# EasyEDA Pro project 电机驱动DRV8701_V1.0.epro

# Schematic DRV8701_V1.0
Board Name: DRV8701_V1.0; Create Date: 2024-12-12
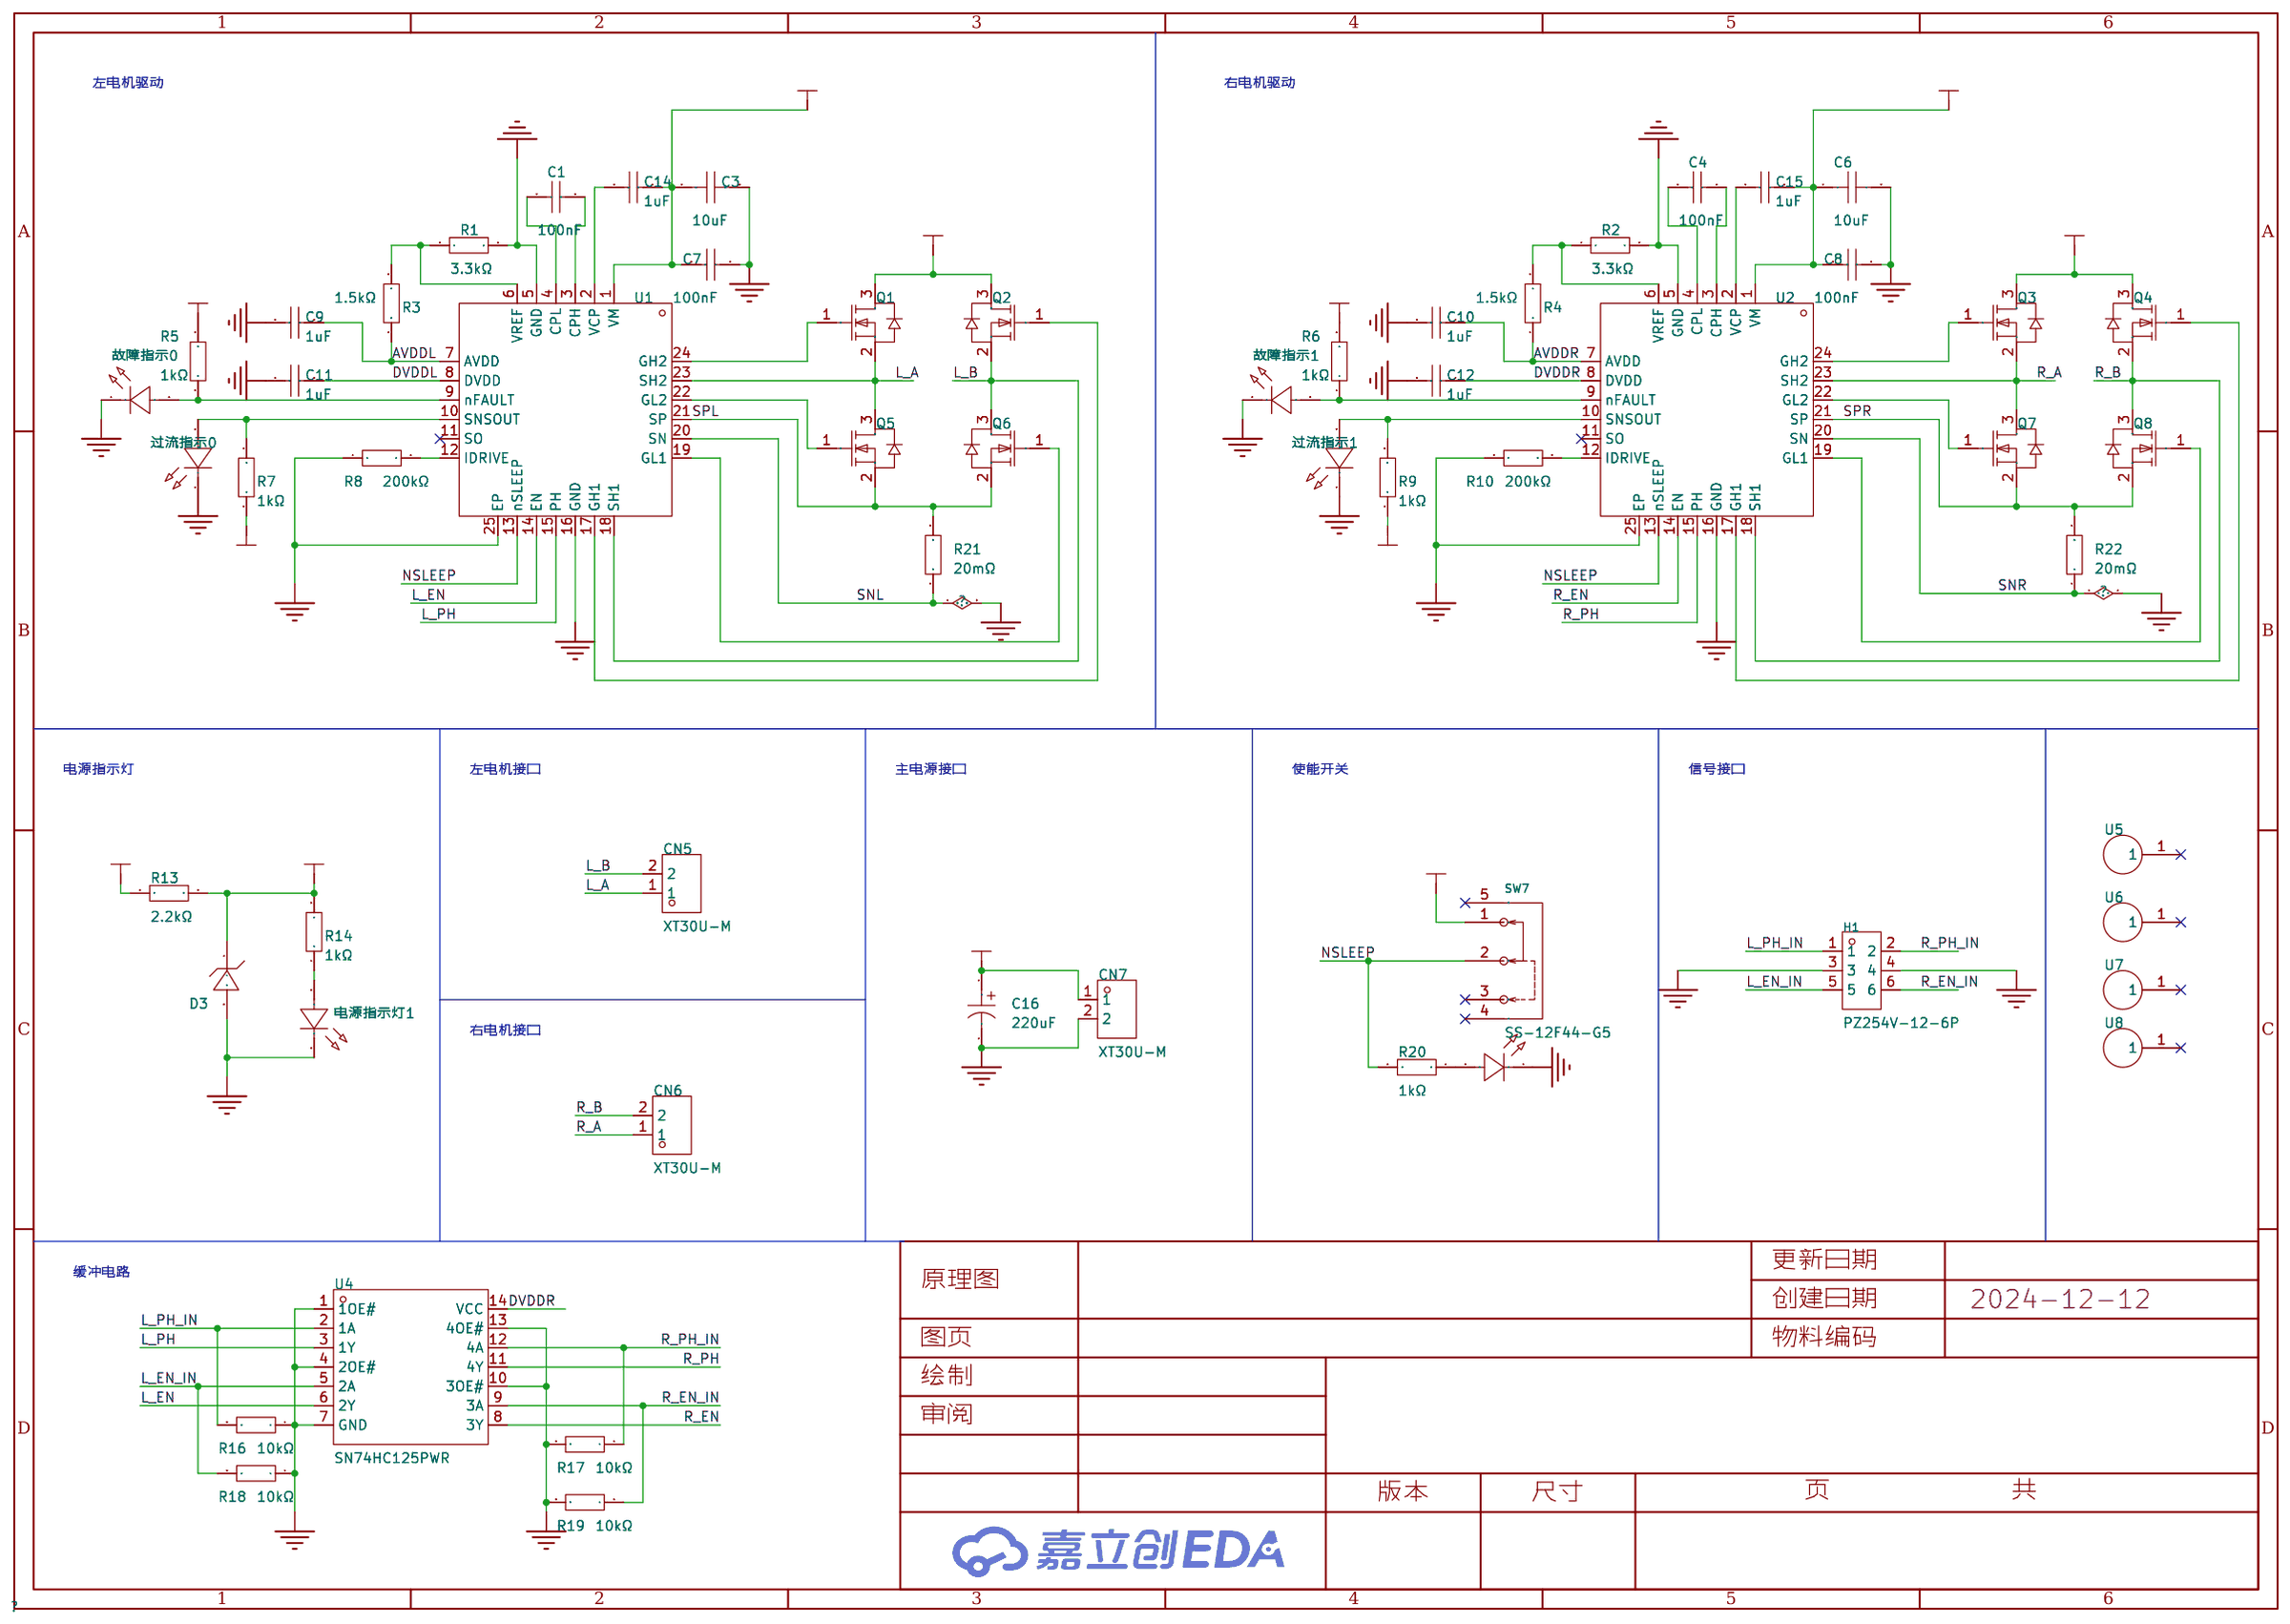
[diagram p0: schematic sheet]

## Parts
C1  100nF  [C0603]
C3  10uF  [C0603]
C4  100nF  [C0603]
C6  10uF  [C0603]
C7  100nF  [C0603]
C8  100nF  [C0603]
C9  1uF  [C0603]
C10  1uF  [C0603]
C11  1uF  [C0603]
C12  1uF  [C0603]
C14  1uF  [C0603]
C15  1uF  [C0603]
C16  220uF  [CAP-TH_BD6.3-P2.50-D0.5-FD]
CN5  XT30U-M  [CONN-TH_XT30U-M]
CN6  XT30U-M  [CONN-TH_XT30U-M]
CN7  XT30U-M  [CONN-TH_XT30U-M]
D3  BZT52C3V3-7-F  [SOD-123_L2.7-W1.6-LS3.7-RD]
H1  PZ254V-12-6P  [HDR-TH_6P-P2.54-V-M-R2-C3-S2.54]
Q1  2N7002  [DSOP-8_L5.0-W5.0-P1.27-LS6.0-BL-EP（rebuild）]
Q2  2N7002  [DSOP-8_L5.0-W5.0-P1.27-LS6.0-BL-EP（rebuild）]
Q3  2N7002  [DSOP-8_L5.0-W5.0-P1.27-LS6.0-BL-EP（rebuild）]
Q4  2N7002  [DSOP-8_L5.0-W5.0-P1.27-LS6.0-BL-EP（rebuild）]
Q5  2N7002  [DSOP-8_L5.0-W5.0-P1.27-LS6.0-BL-EP（rebuild）]
Q6  2N7002  [DSOP-8_L5.0-W5.0-P1.27-LS6.0-BL-EP（rebuild）]
Q7  2N7002  [DSOP-8_L5.0-W5.0-P1.27-LS6.0-BL-EP（rebuild）]
Q8  2N7002  [DSOP-8_L5.0-W5.0-P1.27-LS6.0-BL-EP（rebuild）]
R1  3.3kΩ  [R0603]
R2  3.3kΩ  [R0603]
R3  1.5kΩ  [R0603]
R4  1.5kΩ  [R0603]
R5  1kΩ  [R0603]
R6  1kΩ  [R0603]
R7  1kΩ  [R0603]
R8  200kΩ  [R0603]
R9  1kΩ  [R0603]
R10  200kΩ  [R0603]
R13  2.2kΩ  [R0603]
R14  1kΩ  [R0603]
R16  10kΩ  [R0603]
R17  10kΩ  [R0603]
R18  10kΩ  [R0603]
R19  10kΩ  [R0603]
R20  1kΩ  [R0603]
R21  20mΩ  [R1225]
R22  20mΩ  [R1225]
SW7  SS-12F44-G5  [SW-TH_SS-12F44-G5]
U1  DRV8701ERGET  [VQFN-24_L4.0-W4.0-P0.50-BL-EP2.5]
U2  DRV8701ERGET  [VQFN-24_L4.0-W4.0-P0.50-BL-EP2.5]
U4  SN74HC125PWR  [TSSOP-14_L5.0-W4.4-P0.65-LS6.5-BL]
U5  -  [M3螺丝孔]  (no BOM)
U6  -  [M3螺丝孔]  (no BOM)
U7  -  [M3螺丝孔]  (no BOM)
U8  -  [M3螺丝孔]  (no BOM)
故障指示0  XL-1608SURC-06  [LED0603-RD_RED]
故障指示1  XL-1608SURC-06  [LED0603-RD_RED]
电源指示灯1  XL-1608SURC-06  [LED0603-RD_RED]
电源指示灯2  XL-1608SURC-06  [LED0603-RD_RED]
过流指示0  XL-1608SURC-06  [LED0603-RD_RED]
过流指示1  XL-1608SURC-06  [LED0603-RD_RED]

## Library data of the parts
C1 C4 C7 C8 = CL10B104KO8NNNC: 容值:100nF;精度:±10%;额定电压:16V;材质(温度系数):X7R;; LCSC Part Name: 100nF ±10% 16V; Supplier Part: C66501; Manufacturer: SAMSUNG(三星); Supplier Footprint: 0603; JLCPCB Part Class: 扩展库; Datasheet: https://atta.szlcsc.com/upload/public/pdf/source/20160218/1457707763339.pdf; Supplier: LCSC; Tolerance: ±10%; Voltage Rated: 16V; Temperature Coefficient: X7R
C3 C6 = CL10A106MA8NRNC: 容值:10uF;精度:±20%;额定电压:25V;材质(温度系数):X5R;; LCSC Part Name: 10uF ±20% 25V; Supplier Part: C96446; Manufacturer: SAMSUNG(三星); Supplier Footprint: 0603; Datasheet: https://atta.szlcsc.com/upload/public/pdf/source/20160218/1457707763339.pdf; Supplier: LCSC; Tolerance: ±20%; Voltage Rated: 25V; Temperature Coefficient: X5R
C9-C12 C14 C15 = CL10B105KA8NNNC: 容值:1uF;精度:±10%;额定电压:25V;材质(温度系数):X7R;; LCSC Part Name: 1uF ±10% 25V; Supplier Part: C29936; Manufacturer: SAMSUNG(三星); Supplier Footprint: 0603; Datasheet: https://atta.szlcsc.com/upload/public/pdf/source/20160218/1457707763339.pdf; Supplier: LCSC; Tolerance: ±10%; Voltage Rated: 25V; Temperature Coefficient: X7R
C16 = 03EC0593: 容值:220uF;精度:±20%;额定电压:25V;纹波电流:400mA@100kHz;等效串联电阻:180mΩ@100kHz;; LCSC Part Name: 220uF ±20% 25V; Supplier Part: C2831777; Manufacturer: KNSCHA(科尼盛); Supplier Footprint: 插件,D6.3xL11.5mm; JLCPCB Part Class: 扩展库; Datasheet: https://atta.szlcsc.com/upload/public/pdf/source/20210511/C2831777_389FCE55455AE5EB982141C0CC76B0F0.pdf; Supplier: LCSC; Tolerance: ±20%; Rated Voltage: 25V; Ripple Current: 400mA@100kHz; Equivalent Series Resistance(ESR): 180mΩ@100kHz; Lead Spacing: 2.5mm; φD: 6.3mm; L: 11.5mm; Lifetime @ Temp: 7000hrs@105℃; Operating Temperature: -55℃~+105℃
CN5-CN7 = XT30U-M: 类别:-;类型1:-;; LCSC Part Name: AMASS(艾迈斯)轻量版锂电池插头公头 XT30U-M; Supplier Part: C99101; Manufacturer: AMASS(艾迈斯); JLCPCB Part Class: 扩展库; Datasheet: https://atta.szlcsc.com/upload/public/pdf/source/20170606/1496716542582.pdf; Supplier: LCSC; Brand: 艾迈斯; Type: 插头; Colour: 黄色; InterfaceType: 公头
D3 = BZT52C3V3-7-F: 二极管配置:独立式;稳压值(标称值):3.3V;稳压值(范围):3.1V~3.5V;功率:500mW;精度:±6%;; Supplier Part: C151564; Manufacturer: DIODES(美台); Supplier Footprint: SOD-123; Datasheet: https://atta.szlcsc.com/upload/public/pdf/source/20190711/C397931_3C6B91801DE45802E2D186F3C264AC27.pdf; Supplier: LCSC; Diode Configuration: 独立式; Zener Voltage (Nom): 3.3V; Reverse Leakage Current (Ir): 5uA@1V; Zener Voltage (Range): 3.1V~3.5V; Power Dissipation: 500mW; Zener Impedance (Zzt): 95Ω; Tolerance: ±6%
H1 = PZ254V-12-6P: 排数:双排;总PIN位数:6P;间距:2.54mm;插针结构:2x3P;行距:2.54mm;安装类型:直插;圆针/方针:方针;额定电流:-;额定电压:-;配合针长度:6mm;塑高:2.5mm;端接针长度:3mm;触头材质:黄铜;触头镀层:-;工作温度范围:-40℃~+105℃;颜色:黑色;; LCSC Part Name: 2.54mm 2x3P 直插 方针; Supplier Part: C492420; Manufacturer: XFCN(兴飞); Supplier Footprint: 插件,P=2.54mm; JLCPCB Part Class: Extended Part; Datasheet: https://atta.szlcsc.com/upload/public/pdf/source/20200309/C492420_BAECB307B001054C09D200388220EAE6.pdf; Supplier: LCSC; Number of Rows: 双排; Number of Pins: 6P; Pitch: 2.54mm; Pin Structure: 2x3P; Row Spacing: 2.54mm; Mounting Type: 直插; Circluar Pins/Square Pins: 方针; Length of Mating Pin: 6mm; Insulation Height: 2.5mm; Length of End Connection Pin: 3mm; Contact Material: 黄铜; Operating Temperature Range: -40℃~+105℃; Color: 黑色
Q1-Q8 = TPH1R403NL(rebuild): LCSC Part Name: 1个N沟道 耐压:60V 电流:115mA; Supplier Part: C8545; Manufacturer: CJ(江苏长电/长晶); Supplier Footprint: SOT-23; Datasheet: https://atta.szlcsc.com/upload/public/pdf/source/20171228/C164913_15144413269051213916.pdf; Supplier: LCSC; Type: 1个N沟道; Drain Source Voltage (Vdss): 60V; Continuous Drain Current (Id): 115mA; Drain Source On Resistance (RDS(on)@Vgs,Id): 5Ω@10V; Power Dissipation (Pd): 225mW; Gate Threshold Voltage (Vgs(th)@Id): 2.5V@250uA; Input Capacitance (Ciss@Vds): 50pF; Reverse Transfer Capacitance (Crss@Vds): 5pF; Operating Temperature: -55℃~+150℃
R1 R2 = 0603WAF3301T5E: 电阻类型:厚膜电阻;阻值:3.3kΩ;精度:±1%;功率:100mW;最大工作电压:75V;温度系数:±100ppm/℃;; LCSC Part Name: 3.3kΩ ±1% 100mW 厚膜电阻; Supplier Part: C22978; Manufacturer: UNI-ROYAL(厚声); Supplier Footprint: 0603; Datasheet: https://atta.szlcsc.com/upload/public/pdf/source/20200306/C422600_1E6D84923E4A46A82E41ADD87F860B5C.pdf; Supplier: LCSC; Type: 厚膜电阻; Tolerance: ±1%; Power(Watts): 100mW; Overload Voltage (Max): 75V; Temperature Coefficient: ±100ppm/℃; Operating Temperature Range: -55℃~+155℃
R3 R4 = 0603WAF1501T5E: 电阻类型:厚膜电阻;阻值:1.5kΩ;精度:±1%;功率:100mW;最大工作电压:75V;温度系数:±100ppm/℃;; LCSC Part Name: 1.5kΩ ±1% 100mW 厚膜电阻; Supplier Part: C22843; Manufacturer: UNI-ROYAL(厚声); Supplier Footprint: 0603; Datasheet: https://atta.szlcsc.com/upload/public/pdf/source/20200306/C422600_1E6D84923E4A46A82E41ADD87F860B5C.pdf; Supplier: LCSC; Type: 厚膜电阻; Tolerance: ±1%; Power(Watts): 100mW; Overload Voltage (Max): 75V; Temperature Coefficient: ±100ppm/℃; Operating Temperature Range: -55℃~+155℃
R5-R7 R9 R14 R20 = 0603WAF1001T5E: 电阻类型:厚膜电阻;阻值:1kΩ;精度:±1%;功率:100mW;最大工作电压:75V;温度系数:±100ppm/℃;; LCSC Part Name: 1kΩ ±1% 100mW 厚膜电阻; Supplier Part: C21190; Manufacturer: UNI-ROYAL(厚声); Supplier Footprint: 0603; JLCPCB Part Class: 基础库; Datasheet: https://atta.szlcsc.com/upload/public/pdf/source/20200306/C422600_1E6D84923E4A46A82E41ADD87F860B5C.pdf; Supplier: LCSC; Type: 厚膜电阻; Tolerance: ±1%; Power(Watts): 100mW; Overload Voltage (Max): 75V; Temperature Coefficient: ±100ppm/℃; Operating Temperature Range: -55℃~+155℃
R8 R10 = 0603WAF2003T5E: 电阻类型:厚膜电阻;阻值:200kΩ;精度:±1%;功率:100mW;最大工作电压:75V;温度系数:±100ppm/℃;; LCSC Part Name: 200kΩ ±1% 100mW 厚膜电阻; Supplier Part: C25811; Manufacturer: UNI-ROYAL(厚声); Supplier Footprint: 0603; Datasheet: https://atta.szlcsc.com/upload/public/pdf/source/20200306/C422600_1E6D84923E4A46A82E41ADD87F860B5C.pdf; Supplier: LCSC; Type: 厚膜电阻; Tolerance: ±1%; Power(Watts): 100mW; Overload Voltage (Max): 75V; Temperature Coefficient: ±100ppm/℃; Operating Temperature Range: -55℃~+155℃
R13 = 0603WAF2201T5E: 电阻类型:厚膜电阻;阻值:2.2kΩ;精度:±1%;功率:100mW;最大工作电压:75V;温度系数:±100ppm/℃;; LCSC Part Name: 2.2kΩ ±1% 100mW 厚膜电阻; Supplier Part: C4190; Manufacturer: UNI-ROYAL(厚声); Supplier Footprint: 0603; JLCPCB Part Class: 基础库; Datasheet: https://atta.szlcsc.com/upload/public/pdf/source/20200306/C422600_1E6D84923E4A46A82E41ADD87F860B5C.pdf; Supplier: LCSC; Type: 厚膜电阻; Tolerance: ±1%; Power(Watts): 100mW; Overload Voltage (Max): 75V; Temperature Coefficient: ±100ppm/℃; Operating Temperature Range: -55℃~+155℃
R16-R19 = 0603WAF1002T5E: 电阻类型:厚膜电阻;阻值:10kΩ;精度:±1%;功率:100mW;最大工作电压:75V;温度系数:±100ppm/℃;; LCSC Part Name: 厚膜电阻 10kΩ ±1% 100mW; Supplier Part: C25804; Manufacturer: UNI-ROYAL(厚声); Supplier Footprint: 0603; JLCPCB Part Class: 基础库; Datasheet: https://atta.szlcsc.com/upload/public/pdf/source/20200306/C422600_1E6D84923E4A46A82E41ADD87F860B5C.pdf; Supplier: LCSC; Type: 厚膜电阻; Tolerance: ±1%; Power(Watts): 100mW; Overload Voltage (Max): 75V; Temperature Coefficient: ±100ppm/℃; Operating Temperature Range: -55℃~+155℃
R21 R22 = CS25FTFR020: 阻值:20mΩ;精度:±1%;功率:3W;温度系数:±200ppm/℃;; LCSC Part Name: 20mΩ ±1% 3W; Supplier Part: C316192; Manufacturer: Viking(光颉); Supplier Footprint: 1225; JLCPCB Part Class: 扩展库; Datasheet: https://atta.szlcsc.com/upload/public/pdf/source/20181023/C316195_01C52CFF62541A3F740CC971DFEB7970.pdf; Supplier: LCSC; Tolerance: ±1%; Power(Watts): 3W; Temperature Coefficient: ±200ppm/℃
SW7 = SS-12F44-G5_C136718: 额定电流(DC):-;额定电压(DC):-;额定电流(AC):-;额定电压(AC):-;电路结构:单刀双掷;安装方式:直插;机械寿命:5千次;; LCSC Part Name: 直插双档 滑动开关; Supplier Part: C136718; Manufacturer: 韩国韩荣; Supplier Footprint: 插件; JLCPCB Part Class: 扩展库; Datasheet: https://atta.szlcsc.com/upload/public/pdf/source/20171123/C136718_15114108132111137440.pdf; Supplier: LCSC; Circuit: 单刀双掷; Mounting Style: 直插; Mechanical Life: 5千次; Actuator Style: 矩形柱状; Pin Style: PC引脚; Operating Temperature: -25℃~+70℃; Switch Height: 11mm
U1 U2 = DRV8701ERGET: DRV8701 47V H 桥智能栅极驱动器; LCSC Part Name: 有刷直流电机驱动芯片 5.5V; Supplier Part: C132049; Manufacturer: TI(德州仪器); Supplier Footprint: VQFN-24(4x4); Datasheet: https://www.ti.com/cn/lit/gpn/drv8701; Supplier: LCSC
U4 = SN74HC125PWR: 输入类型:-;电源电压:2V~6V;元件数:4;每个元件位数:1;灌电流(IOL):7.8mA;拉电流(IOH):7.8mA;; Supplier Part: C132994; Manufacturer: TI(德州仪器); Supplier Footprint: TSSOP-14; JLCPCB Part Class: 扩展库; Datasheet: https://www.ti.com/cn/lit/gpn/sn74hc125; Supplier: LCSC; output type: 三态; Supply Voltage: 2V~6V; Number of Elements: 4; Number of Bits per Element: 1; Sink Current: 7.8mA; Source Current: 7.8mA; Logic Family: 74HC; Operating Temperature: -40℃~+85℃
U5-U8 = M3螺丝孔
故障指示0 故障指示1 电源指示灯1 电源指示灯2 过流指示0 过流指示1 = XL-1608SURC-06: 发光颜色:红色;功率:55mW;正向电流:25mA;主波长:617nm~621nm;透镜颜色:无色透明透镜;色温:-;发光角度:120°;载带方式:正贴;工作温度:-30℃~+85℃;; Supplier Part: C965799; Manufacturer: XINGLIGHT(成兴光); Supplier Footprint: 0603; Datasheet: https://atta.szlcsc.com/upload/public/pdf/source/20221102/D860AFDD1CDB02C5A8064103A32707E2.pdf; Supplier: LCSC; Emitted Color: 红色; Power Dissipation: 55mW; Forward Current: 25mA; Dominant Wavelength: 617nm~621nm; Peak Wavelength: 623nm; Lens Color: 无色透明透镜; Viewing Angle: 120°; Mounting Sytle: 正贴; Operating Temperature: -30℃~+85℃

## Nets
3.3V: D3.1(K) R13.2 R14.2 SW7.1
AVDDL: C9.1 R3.1 U1.7(AVDD)
AVDDR: C10.1 R4.1 U2.7(AVDD)
DVDDL: C11.1 R5.2 R7.1 U1.8(DVDD)
DVDDR: C12.1 R6.2 R9.1 U2.8(DVDD) U4.14(VCC)
GND: C3.2 C6.2 C7.1 C8.1 C9.2 C10.2 C11.2 C12.2 C16.2 CN7.2 D3.2(A) H1.3 H1.4 R1.2 R2.2 R8.1 R10.1 R16.1 R17.2 R18.1 R19.2 R21.1 R22.1 U1.5(GND) U1.16(GND) U1.20(SN) U1.25(EP) U2.5(GND) U2.16(GND) U2.20(SN) U2.25(EP) U4.1(1OE#) U4.4(2OE#) U4.7(GND) U4.10(3OE#) U4.13(4OE#) 故障指示0.1(K) 故障指示1.1(K) 电源指示灯1.1(K) 电源指示灯2.1(K) 过流指示0.1(K) 过流指示1.1(K)
L_A: CN5.1 Q1.2(S) Q5.3(D) U1.23(SH2)
L_B: CN5.2 Q2.2(S) Q6.3(D) U1.18(SH1)
L_EN: U1.14(EN) U4.6(2Y)
L_EN_IN: H1.5 R18.2 U4.5(2A)
L_PH: U1.15(PH) U4.3(1Y)
L_PH_IN: H1.1 R16.2 U4.2(1A)
NSLEEP: R20.2 SW7.2 U1.13(nSLEEP) U2.13(nSLEEP)
R_A: CN6.1 Q3.2(S) Q7.3(D) U2.23(SH2)
R_B: CN6.2 Q4.2(S) Q8.3(D) U2.18(SH1)
R_EN: U2.14(EN) U4.8(3Y)
R_EN_IN: H1.6 R19.1 U4.9(3A)
R_PH: U2.15(PH) U4.11(4Y)
R_PH_IN: H1.2 R17.1 U4.12(4A)
SPL: Q5.2(S) Q6.2(S) R21.2 U1.21(SP)
SPR: Q7.2(S) Q8.2(S) R22.2 U2.21(SP)
VM: C3.1 C6.1 C7.2 C8.2 C14.1 C15.1 C16.1 CN7.1 Q1.3(D) Q2.3(D) Q3.3(D) Q4.3(D) R13.1 U1.1(VM) U2.1(VM)
$1N2924: C14.2 U1.2(VCP)
$1N2925: C1.1 U1.3(CPH)
$1N2926: C1.2 U1.4(CPL)
$1N2930: Q1.1(G) U1.24(GH2)
$1N2931: Q5.1(G) U1.22(GL2)
$1N2933: Q6.1(G) U1.19(GL1)
$1N2936: Q2.1(G) U1.17(GH1)
$1N2948: R8.2 U1.12(IDRIVE)
$1N2972: R1.1 R3.2 U1.6(VREF)
$1N2976: R5.1 U1.9(nFAULT) 故障指示0.2(A)
$1N2979: R7.2 U1.10(SNSOUT) 过流指示0.2(A)
$1N2986: C15.2 U2.2(VCP)
$1N2987: C4.1 U2.3(CPH)
$1N2988: C4.2 U2.4(CPL)
$1N2992: Q3.1(G) U2.24(GH2)
$1N2993: Q7.1(G) U2.22(GL2)
$1N2995: Q8.1(G) U2.19(GL1)
$1N2998: Q4.1(G) U2.17(GH1)
$1N3010: R10.2 U2.12(IDRIVE)
$1N3014: R2.1 R4.2 U2.6(VREF)
$1N3018: R6.1 U2.9(nFAULT) 故障指示1.2(A)
$1N3021: R9.2 U2.10(SNSOUT) 过流指示1.2(A)
$1N3029: R14.1 电源指示灯1.2(A)
$1N3716: R20.1 电源指示灯2.2(A)

Not connected (* = marked no-connect by the designer): SW7 3* 4* 5*; U1 11(SO)*; U2 11(SO)*; U5 1*; U6 1*; U7 1*; U8 1*

## Notes on the sheet
- 左电机驱动
- 右电机驱动
- 电源指示灯
- 左电机接口
- 主电源接口
- 使能开关
- 信号接口
- 右电机接口
- 缓冲电路

# Board DRV8701_V1.0
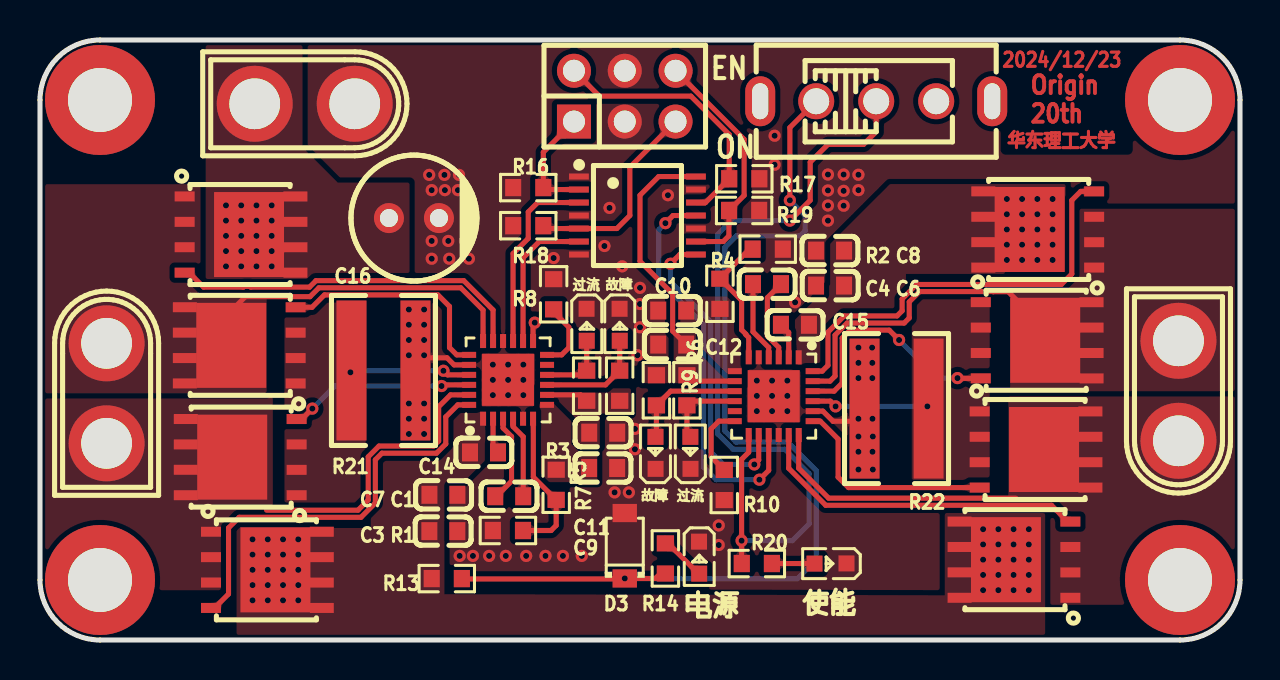
[diagram p1: board, top side]
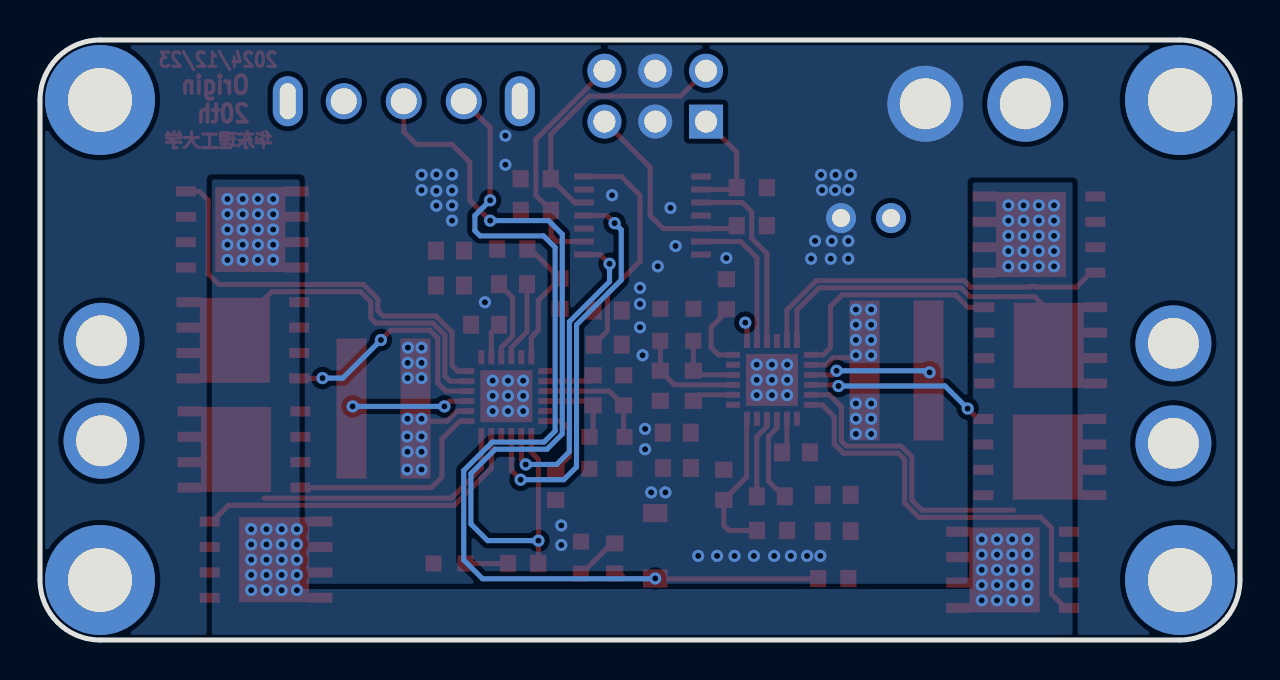
[diagram p2: board, bottom side, seen from below]

Outline 60 x 30 mm; copper layers: Top Layer, Inner1, Inner2, Bottom Layer. Coordinates in mm from the lower left corner of the outline.
Outline path: 0,27 0,3 arc(0.88,0.88) 3,0 57,0 arc(59.12,0.88) 60,3 60,27 arc(59.12,29.12) 57,30 3,30 arc(0.88,29.12) 0,27
Stack: Top Layer 0.035mm 外层铜厚1oz / Dielectric1 0.2104mm 7628 RC49% 8.6mil / Inner1 0.0152mm 内层铜厚 / Dielectric2 1.065mm 1.1mm H/HOZ Copper / Inner2 0.0152mm 内层铜厚 / Dielectric3 0.2104mm 7628 RC49% 8.6mil / Bottom Layer 0.035mm 外层铜厚1oz

## Design rules (mm)
template: 4层
spacing copperThickness1oz (default): track to track 0.102, other pairs 0.152 to 0.3
spacing copperThickness2oz: track to track 0.203, other pairs 0.152 to 0.3
spacing copperThicknessInner0.5oz: track to track 0.089, other pairs 0.152 to 0.3
spacing 板框焊盘0间距: track to track 0.152, other pairs 0 to 0.3
track width copperThickness1oz (default): min 0.102, default 0.254, max 2.54
track width copperThickness2oz: min 0.203, default 0.254, max 2.54
track width copperThickness0.5oz: min 0.089, default 0.254, max 2.54
differential pair differentialPair (default): width min 0.127, default 0.254, max 2.54; gap min 0.152, default 0.152
via viaSize (default): diameter min 0.3, default 0.61, max 10; hole min 0.2, default 0.305, max 6.3
region e13 uses 板框焊盘0间距
region e14 uses 板框焊盘0间距
region e15 uses 板框焊盘0间距
region e59 uses 板框焊盘0间距

## Placement (name value [footprint] x y rotation side)
C1  100nF  [C0603]  23.46 7.19 0 top
C3  10uF  [C0603]  20.17 5.44 0 top
C4  100nF  [C0603]  36.35 17.79 180 top
C6  10uF  [C0603]  39.5 17.72 180 top
C7  100nF  [C0603]  20.17 7.26 180 top
C8  100nF  [C0603]  39.5 19.47 0 top
C9  1uF  [C0603]  28.16 8.6 0 top
C10  1uF  [C0603]  31.61 16.47 180 top
C11  1uF  [C0603]  28.16 10.37 0 top
C12  1uF  [C0603]  31.61 14.77 180 top
C14  1uF  [C0603]  22.2 9.38 0 top
C15  1uF  [C0603]  37.75 15.76 180 top
C16  220uF  [CAP-TH_BD6.3-P2.50-D0.5-FD]  18.7 21.1 0 top
CN5  XT30U-M  [CONN-TH_XT30U-M]  3.33 12.33 90 top
CN6  XT30U-M  [CONN-TH_XT30U-M]  56.92 12.46 270 top
CN7  XT30U-M  [CONN-TH_XT30U-M]  13.24 26.81 0 top
D3  BZT52C3V3-7-F  [SOD-123_L2.7-W1.6-LS3.7-RD]  29.24 4.71 90 top
H1  PZ254V-12-6P  [HDR-TH_6P-P2.54-V-M-R2-C3-S2.54]  29.24 27.19 0 top
Q1  2N7002  [DSOP-8_L5.0-W5.0-P1.27-LS6.0-BL-EP（rebuild）]  11.32 3.51 270 top
Q2  2N7002  [DSOP-8_L5.0-W5.0-P1.27-LS6.0-BL-EP（rebuild）]  10 20.27 270 top
Q3  2N7002  [DSOP-8_L5.0-W5.0-P1.27-LS6.0-BL-EP（rebuild）]  49.94 20.53 90 top
Q4  2N7002  [DSOP-8_L5.0-W5.0-P1.27-LS6.0-BL-EP（rebuild）]  48.75 4.02 90 top
Q5  2N7002  [DSOP-8_L5.0-W5.0-P1.27-LS6.0-BL-EP（rebuild）]  10.06 9.14 90 top
Q6  2N7002  [DSOP-8_L5.0-W5.0-P1.27-LS6.0-BL-EP（rebuild）]  10.01 14.73 90 top
Q7  2N7002  [DSOP-8_L5.0-W5.0-P1.27-LS6.0-BL-EP（rebuild）]  49.81 14.99 270 top
Q8  2N7002  [DSOP-8_L5.0-W5.0-P1.27-LS6.0-BL-EP（rebuild）]  49.75 9.53 270 top
R1  3.3kΩ  [R0603]  23.4 5.47 180 top
R2  3.3kΩ  [R0603]  36.39 19.54 0 top
R3  1.5kΩ  [R0603]  25.81 7.76 270 top
R4  1.5kΩ  [R0603]  34 17.31 90 top
R5  1kΩ  [R0603]  28.98 12.71 270 top
R6  1kΩ  [R0603]  30.82 12.48 90 top
R7  1kΩ  [R0603]  27.33 12.71 90 top
R8  200kΩ  [R0603]  25.68 17.29 270 top
R9  1kΩ  [R0603]  32.34 12.48 270 top
R10  200kΩ  [R0603]  34.21 7.75 90 top
R13  2.2kΩ  [R0603]  20.34 3.07 0 top
R14  1kΩ  [R0603]  31.27 4.08 270 top
R16  10kΩ  [R0603]  24.41 22.62 0 top
R17  10kΩ  [R0603]  35.22 23.06 0 top
R18  10kΩ  [R0603]  24.41 20.72 0 top
R19  10kΩ  [R0603]  35.21 21.48 0 top
R20  1kΩ  [R0603]  35.84 3.82 180 top
R21  20mΩ  [R1225]  17.17 13.48 180 top
R22  20mΩ  [R1225]  42.83 11.57 0 top
SW7  SS-12F44-G5  [SW-TH_SS-12F44-G5]  41.81 26.94 0 top
U1  DRV8701ERGET  [VQFN-24_L4.0-W4.0-P0.50-BL-EP2.5]  23.4 13.01 0 top
U2  DRV8701ERGET  [VQFN-24_L4.0-W4.0-P0.50-BL-EP2.5]  36.69 12.19 180 top
U4  SN74HC125PWR  [TSSOP-14_L5.0-W4.4-P0.65-LS6.5-BL]  29.87 21.22 270 top
U5  -  [M3螺丝孔]  57 27 0 top
U6  -  [M3螺丝孔]  57 3 0 top
U7  -  [M3螺丝孔]  3 3 0 top
U8  -  [M3螺丝孔]  3 27 0 top
故障指示0  XL-1608SURC-06  [LED0603-RD_RED]  28.98 15.76 270 top
故障指示1  XL-1608SURC-06  [LED0603-RD_RED]  30.78 9.36 90 top
电源指示灯1  XL-1608SURC-06  [LED0603-RD_RED]  32.96 4.12 270 top
电源指示灯2  XL-1608SURC-06  [LED0603-RD_RED]  39.53 3.82 180 top
过流指示0  XL-1608SURC-06  [LED0603-RD_RED]  27.33 15.76 270 top
过流指示1  XL-1608SURC-06  [LED0603-RD_RED]  32.52 9.36 90 top

## Footprints (pads in the part's own frame, mm; a bottom-side part is the same pattern mirrored in y, then rotated)
C0603
  rect 0.8x0.9 smd: 1(-0.7,0) 2(0.7,0)
CAP-TH_BD6.3-P2.50-D0.5-FD
  round 1.5 hole 0.9: 1(-1.25,0) 2(1.25,0)
CONN-TH_XT30U-M
  round 3.8 hole 2.54: 1(-2.5,0) 2(2.5,0)
DSOP-8_L5.0-W5.0-P1.27-LS6.0-BL-EP（rebuild）
  rect 0.5x1 smd: 1(1.905,-2.77) 2(-1.905,-2.77) 2(-0.635,-2.77) 2(0.634,-2.77)
  rect 0.5x1.2 smd: 3(-1.905,2.77) 3(-0.634,2.77) 3(0.635,2.77) 3(1.905,2.77)
  custom 4.25x3.5 smd: 3(0,0.45)
HDR-TH_6P-P2.54-V-M-R2-C3-S2.54
  rect 1.7x1.7 hole 1.1: 1(-2.54,-1.27)
  round 1.7 hole 1.1: 2(-2.54,1.27) 3(0,-1.27) 4(0,1.27) 5(2.54,-1.27) 6(2.54,1.27)
LED0603-RD_RED
  rect 0.8x0.8 smd: 1(-0.799,-0.004) 2(0.799,0.004)
M3螺丝孔
  round 5.5 hole 3.2: 1(0,0)
R0603
  rect 0.806x0.864 smd: 1(-0.753,0) 2(0.753,0)
R1225
  rect 1.5x7 smd: 1(-1.6,0) 2(1.6,0)
SOD-123_L2.7-W1.6-LS3.7-RD
  rect 0.91x1.22 smd: 1(-1.635,0) 2(1.635,0)
SW-TH_SS-12F44-G5
  round 1.8 hole 1.3: 1(-3,0) 2(0,0) 3(3,0)
  oval 1.5x2.5 hole 0.8x1.8: 4(5.8,0) 5(-5.8,0)
TSSOP-14_L5.0-W4.4-P0.65-LS6.5-BL
  rect 0.305x0.991 smd: 1(-1.95,-2.925) 2(-1.3,-2.925) 3(-0.65,-2.925) 4(0,-2.925) 5(0.65,-2.925) 6(1.3,-2.925) 7(1.95,-2.925) 8(1.95,2.925) 9(1.3,2.925) 10(0.65,2.925) 11(0,2.925) 12(-0.65,2.925) 13(-1.3,2.925) 14(-1.95,2.925)
VQFN-24_L4.0-W4.0-P0.50-BL-EP2.5
  rect 0.3x0.7 smd: 1(-1.25,-1.942) 2(-0.75,-1.942) 3(-0.25,-1.942) 4(0.25,-1.942) 5(0.75,-1.942) 6(1.25,-1.942) 13(1.25,1.942) 14(0.75,1.942) 15(0.25,1.942) 16(-0.25,1.942) 17(-0.75,1.942) 18(-1.25,1.942)
  rect 0.7x0.3 smd: 7(1.948,-1.25) 8(1.948,-0.75) 9(1.948,-0.25) 10(1.948,0.25) 11(1.948,0.75) 12(1.948,1.25) 19(-1.948,1.25) 20(-1.948,0.75) 21(-1.948,0.25) 22(-1.948,-0.25) 23(-1.948,-0.75) 24(-1.948,-1.25)
  rect 2.6x2.6 smd: 25(0.001,-0.001)

## Nets
As in the schematic.

Pads without a net: SW7 3 4 5; U1 11; U2 11; U5 1; U6 1; U7 1; U8 1

## Via types
v1: diameter 0.61, hole 0.305, Top Layer to Bottom Layer, 190 vias

## Routing (per net, layer and track width the routed paths; a pad name or vN(x,y) marks a point on that pad's centre or on a via; arc(x,y) is an arc through that point)
3.3V: length 51
  Top Layer w0.254: R13.2 21.11,3.05 29.21,3.05 v1(29.24,3.08) 30.77,3.08 31.02,3.32 R14.2 ; SW7.1 37.49,25.62 v1(37.49,21.98)
  Bottom Layer w0.254: v1(29.24,3.08) 29.25,3.06 37.87,3.06 38.81,4 38.81,8.47 37.39,9.89 34.8,9.89 34.24,10.45 34.24,19.62 34.83,20.21 38,20.21 38.25,20.46 38.25,21.22 v1(37.49,21.98)
DVDDL: length 2.1
  Top Layer w0.254: R7.1 27.04,12.26 U1.8
DVDDR: length 14.1
  Top Layer w0.254: 34.74,12.94 32.51,12.94 32.34,13.11 ; U4.14 30.93,23.17 30,22.24 30,18.94 31.63,17.3 31.63,15.45 C12.1
GND: length 5.6
  Top Layer w0.254: U1.20 20.7,13.76 20.35,14.11 19.41,14.11 R21.1 ; v1(40.92,11.06) 40.79,10.94 39.65,10.94 39.15,11.44 U2.20
  vias: v1(18.44,16.52) v1(18.44,15.76) v1(18.44,15) v1(18.44,14.24) v1(18.44,11.83) v1(18.44,11.06) v1(18.44,10.3) v1(19.21,16.52) v1(19.21,15.76) v1(19.21,15) v1(19.21,14.24) v1(19.21,11.83) v1(19.21,11.06) v1(19.21,10.3) v1(19.46,23.25) v1(19.59,22.49) v1(19.59,19.95) v1(19.59,19.06) v1(20.22,23.25) v1(20.24,22.49) v1(20.41,19.95) v1(20.46,19.06) v1(20.95,23.25) v1(20.9,22.49) v1(20.98,4.2) v1(21.25,19.95) v1(21.44,19.06) v1(21.65,4.2) v1(22.46,4.2) v1(22.64,13.77) v1(22.64,13.01) v1(22.64,12.24) v1(23.29,4.2) v1(23.41,13.77) v1(23.41,13.01) v1(23.41,12.24) v1(24.17,13.77) v1(24.17,13.01) v1(24.17,12.24) v1(24.31,4.2) v1(25.28,4.2) v1(25.68,19.1) v1(26.15,4.2) v1(27.09,4.2) v1(28.22,19.7) v1(28.48,21.6) v1(28.73,7.38) v1(29.11,18.68) v1(29.44,7.38) v1(29.75,10.56) v1(29.75,9.54) v1(29.87,14.24) v1(30,17.61) v1(30,16.8) v1(30,15.64) v1(31.4,22.24) v1(33.94,5.73) v1(33.94,4.75) v1(35.84,12.97) v1(35.84,12.21) v1(35.84,11.44) v1(36.6,12.97) v1(36.6,12.21) v1(36.6,11.44) v1(36.73,25.21) v1(36.73,23.76) v1(37.37,12.97) v1(37.37,12.21) v1(37.37,11.44) v1(37.75,16.89) v1(39.4,23.27) v1(39.4,22.48) v1(39.4,21.73) v1(39.4,20.97) v1(40.18,23.27) v1(40.18,22.46) v1(40.18,21.72) v1(40.92,23.26) v1(40.92,22.49) v1(40.92,14.62) v1(40.92,13.86) v1(40.92,13.09) v1(40.92,10.17) v1(40.92,9.41) v1(40.92,8.52) v1(41.6,14.62) v1(41.62,13.86) v1(41.62,13.09) v1(41.63,11.06) v1(41.64,10.17) v1(41.63,9.41) v1(41.64,8.52)
L_A: length 14.8
  Top Layer w0.254: 11.33,6.49 15.9,6.49 16.41,7 16.41,9.16 16.95,9.7 19.68,9.7 19.93,9.95 19.93,11.66 20.53,12.26 U1.23
L_B: length 16.8
  Top Layer w0.254: U1.18 22.15,16.5 21.04,17.61 13.95,17.61 13.5,17.17 10.27,17.17 9.56,16.46 9.56,14.73
L_EN: length 7.3
  Top Layer w0.254: U4.6 24.97,19.92 24.15,19.11 U1.14
L_EN_IN: length 10.2
  Top Layer w0.254: H1.5 29.49,23.64 29.49,21.22 28.84,20.57 U4.5 25.18,20.57 25.17,20.59
L_PH: length 9.5
  Top Layer w0.254: U1.15 23.65,19.32 24.41,20.08 24.41,21.4 24.88,21.87 U4.3
L_PH_IN: length 5.7
  Top Layer w0.254: 25.17,22.49 25.2,22.52 U4.2 ; H1.1 25.17,24.39 R16.2
NSLEEP: length 66.8
  Top Layer w0.254: v1(24.74,15.87) 24.65,15.78 U1.13 ; U2.13 35.44,9.39 35.08,9.03 v1(35.08,4.97) 35.08,3.83 R20.2 ; SW7.2 41.81,25.41 41.18,24.78 39.4,24.78 38.51,23.89 38.51,21.98 v1(37.49,20.97)
  Inner1 w0.254: v1(24.74,15.87) 25.53,15.87 27.04,17.38 27.04,22.96 28.6,24.53 39.4,24.53 SW7.2
  Bottom Layer w0.254: v1(35.08,4.97) 37.62,4.97 38.46,5.8 38.46,8.32 37.24,9.54 34.65,9.54 33.89,10.3 33.89,20.28 34.57,20.97 v1(37.49,20.97)
R_A: length 16.5
  Top Layer w0.254: Q7.3 50.26,15.57 48.41,17.41 47.66,17.41 47.65,17.42 43.98,17.42 43.46,16.91 43.46,16.1 43.21,15.85 40.36,15.85 39.75,15.25 39.75,13.2 39.5,12.94 U2.23
R_B: length 13.1
  Top Layer w0.254: U2.18 37.94,8.59 39.43,7.09 48.8,7.09
R_EN: length 15.7
  Top Layer w0.254: U2.14 35.94,9 v1(35.72,8.78) ; U4.8 31.99,19.27 v1(31.52,18.81)
  Bottom Layer w0.254: v1(31.52,18.81) 31.52,17.92 33.53,15.91 33.53,9.41 34.17,8.78 v1(35.72,8.78)
R_EN_IN: length 11.8
  Top Layer w0.254: H1.6 35.21,25.03 35.21,22.23 R19.1 34.44,21.47 34.44,20.21 34.16,19.92 U4.9
R_PH: length 20.4
  Top Layer w0.254: v1(35.97,8.02) 36.44,8.48 U2.15 ; v1(31.27,20.84) 31.65,21.22 U4.11
  Bottom Layer w0.254: v1(35.97,8.02) 33.81,8.02 33.18,8.65 33.18,15.76 30.94,18 30.94,20.51 v1(31.27,20.84)
R_PH_IN: length 13.5
  Top Layer w0.254: U4.12 33.27,21.87 R17.1 34.46,25.27 32.54,27.19 27.97,27.19 H1.2
SPL: length 6.2
  Top Layer w0.254: v1(20.17,13.46) 20.38,13.26 U1.21 ; R21.2 15.52,13.42 v1(15.52,13.38)
  Bottom Layer w0.254: v1(15.52,13.38) 15.6,13.46 v1(20.17,13.46)
SPR: length 5.8
  Top Layer w0.254: U2.21 39.52,11.94 v1(39.78,11.68)
  Bottom Layer w0.254: v1(39.78,11.68) v1(44.37,11.68)
VM:
  vias: v1(9.3,21.73) v1(9.3,20.97) v1(9.3,20.21) v1(9.3,19.44) v1(9.3,18.68) v1(10.06,21.73) v1(10.06,20.97) v1(10.06,20.21) v1(10.06,19.44) v1(10.06,18.68) v1(10.63,5.03) v1(10.63,4.27) v1(10.63,3.51) v1(10.63,2.75) v1(10.63,1.98) v1(10.82,21.73) v1(10.82,20.97) v1(10.82,20.21) v1(10.82,19.44) v1(10.82,18.68) v1(11.39,5.03) v1(11.39,4.27) v1(11.39,3.51) v1(11.39,2.75) v1(11.39,1.98) v1(11.59,21.73) v1(11.59,20.97) v1(11.59,20.21) v1(11.59,19.44) v1(11.59,18.68) v1(12.15,5.03) v1(12.15,4.27) v1(12.15,3.51) v1(12.15,2.75) v1(12.15,1.98) v1(12.91,5.03) v1(12.91,4.27) v1(12.91,3.51) v1(12.91,2.75) v1(12.91,1.98) v1(47.16,5.54) v1(47.16,4.78) v1(47.16,4.02) v1(47.16,3.25) v1(47.16,2.49) v1(47.92,5.54) v1(47.92,4.78) v1(47.92,4.02) v1(47.92,3.25) v1(47.92,2.49) v1(48.34,22.05) v1(48.34,21.29) v1(48.34,20.53) v1(48.34,19.76) v1(48.34,19) v1(48.68,5.54) v1(48.68,4.78) v1(48.68,4.02) v1(48.68,3.25) v1(48.68,2.49) v1(49.1,22.05) v1(49.1,21.29) v1(49.1,20.53) v1(49.1,19.76) v1(49.1,19) v1(49.44,5.54) v1(49.44,4.78) v1(49.44,4.02) v1(49.44,3.25) v1(49.44,2.49) v1(49.87,22.05) v1(49.87,21.29) v1(49.87,20.53) v1(49.87,19.76) v1(49.87,19) v1(50.63,22.05) v1(50.63,21.29) v1(50.63,20.53) v1(50.63,19.76) v1(50.63,19)
$1N2924: length 1.8
  Top Layer w0.254: C14.2 22.65,9.63 U1.2
$1N2925: length 4.5
  Top Layer w0.254: U1.3 23.15,10.6 23.58,10.17 23.58,7.94 22.76,7.13
$1N2926: length 4.1
  Top Layer w0.254: U1.4 23.65,10.67 24.16,10.16 C1.2
$1N2930: length 21.1
  Top Layer w0.254: U1.24 20.89,11.76 20.29,11.16 20.29,9.8 19.83,9.34 17.1,9.34 16.77,9.01 16.77,6.85 16.05,6.14 9.96,6.14 9.43,5.6 9.43,2.3 8.73,1.6 Q1.1
$1N2931: length 9.3
  Top Layer w0.254: v1(20.08,12.7) 20.13,12.76 U1.22 ; v1(13.62,11.57) 13.09,11.05 Q5.1
  Bottom Layer w0.254: v1(20.08,12.7) 14.75,12.7 v1(13.62,11.57)
$1N2933: length 11.4
  Top Layer w0.254: U1.19 20.84,14.26 20.47,14.62 20.47,16.68 19.9,17.25 14.22,17.25 13.6,16.64 Q6.1
$1N2936: length 18
  Top Layer w0.254: U1.17 22.65,16.5 21.19,17.97 13.8,17.97 13.47,17.64 10.54,17.64 10.5,17.68 10.21,17.68 10.17,17.64 8.18,17.64 7.46,18.37 Q2.1
$1N2948: length 3.5
  Top Layer w0.254: 25.56,16.53 25.56,16.52 26.44,15.64 26.44,14.62 26.08,14.26 U1.12
$1N2972: length 7.6
  Top Layer w0.254: R1.1 25.56,5.47 25.81,5.73 R3.2 24.67,8.15 24.67,11.05 U1.6
$1N2976: length 5.4
  Top Layer w0.254: 故障指示0.2 28.98,14.96 R5.1 28.27,12.76 U1.9
$1N2979: length 3.6
  Top Layer w0.254: U1.10 27.12,13.26 R7.2 27.33,14.96 过流指示0.2
$1N2986: length 1.8
  Top Layer w0.254: U2.2 37.44,15.37 C15.2
$1N2987: length 4.2
  Top Layer w0.254: U2.3 36.94,14.63 36.37,15.2 36.37,17.11 C4.1
$1N2988: length 4
  Top Layer w0.254: U2.4 36.44,14.63 35.65,15.41 C4.2
$1N2992: length 21.3
  Top Layer w0.254: Q3.1 52.04,22.43 51.59,21.98 51.59,18.3 51.06,17.78 43.83,17.78 43.11,17.05 43.11,16.46 42.85,16.2 40.21,16.2 39.4,15.39 39.4,13.73 39.11,13.44 U2.24
$1N2993: length 12
  Top Layer w0.254: v1(42.95,15) 42.46,15.49 40.5,15.49 40.11,15.1 40.11,12.85 39.7,12.44 U2.22 ; v1(45.88,13.09) 45.89,13.08 Q7.1
  Bottom Layer w0.254: v1(42.95,15) 44.86,13.09 v1(45.88,13.09)
$1N2995: length 10.8
  Top Layer w0.254: U2.19 39.01,10.94 39.91,10.05 39.91,8.14 40.43,7.62 46.98,7.62
$1N2998: length 16.9
  Top Layer w0.254: Q4.1 51.39,5.92 50.57,6.74 39.28,6.74 37.44,8.58 U2.17
$1N3010: length 3.9
  Top Layer w0.254: 34.74,10.94 33.94,10.94 33.56,10.56 33.56,9.16 34.21,8.5 34.47,8.5
$1N3014: length 6.8
  Top Layer w0.254: U2.6 35.44,15.12 35.29,15.26 35.29,15.29 35.08,15.51 35.08,16.98 R4.2 35.47,19.54 R2.1
$1N3018: length 5.8
  Top Layer w0.254: 故障指示1.2 30.82,10.2 R6.1 31.53,12.44 34.74,12.44
$1N3021: length 4.1
  Top Layer w0.254: 过流指示1.2 32.34,10.33 R9.2 32.56,11.94 34.74,11.94
$1N3029: length 2.4
  Top Layer w0.254: 31.27,5.09 31.27,4.97 32.66,3.57 32.96,3.57
$1N3716: length 2.1
  Top Layer w0.254: 电源指示灯2.2 38.72,3.82 R20.1

## Copper pours and planes (outline as drawn; the poured copper is in the pictures)
AVDDL on Top Layer: 24.96,11.91 25.6,11.91 26.57,10.94 26.57,9.8 27.06,9.31 27.86,9.31 27.86,7.89 25.27,7.89 24.96,8.2
AVDDR on Top Layer: 35.08,13.22 35.08,17.17 31.91,17.17 31.91,15.76 33.05,15.76 33.05,14.61 34.44,13.22
DVDDL on Top Layer: 24.92,12.59 29.54,12.59 29.54,11.33 27.99,11.33 27.99,9.66 26.51,9.66 26.51,10.86 25.43,11.95 24.93,11.95 24.92,11.96
DVDDR on Top Layer: 35.21,12.84 30.13,12.84 30.13,13.74 31.68,13.74 31.68,15.44 32.93,15.44 32.93,14.74 34.44,13.22 35.21,13.22
GND on Top Layer: -0.48,31 61.12,31 61.12,-1.89 -0.48,-1.89
GND on Bottom Layer: -1.24,33.42 61.5,33.42 61.5,-2.4 -1.24,-2.4
GND on Inner1: -1.75,32.4 61.5,32.4 61.5,-2.4 -1.75,-2.4
GND on Inner2: -1.75,32.78 61.5,32.78 61.5,-2.53 -1.75,-2.53
L_A on Top Layer: 0.16,12.22 11.64,12.22 11.64,2.49 0.16,2.49
L_B on Top Layer: 11.33,12.33 0.16,12.33 0.16,22.79 11.33,22.79
R_A on Top Layer: 48.51,21.56 60.1,21.56 60.1,12.44 48.51,12.44
R_B on Top Layer: 48.41,12.33 60.1,12.33 60.1,1.76 48.41,1.76
SPL on Top Layer: 12.23,17.23 16.28,17.23 16.28,6.62 12.23,6.62
SPR on Top Layer: 43.59,17.16 47.48,17.16 47.48,8 43.59,8
VM on Top Layer: 19.58,9.21 16.59,9.21 16.54,9.26 16.54,5.6 13.52,5.6 13.49,5.63 9.83,5.63 9.83,-0.24 50.26,-0.24 50.26,6.39 45.24,6.39 45.24,2.24 20.22,2.29 20.22,7.68 20.96,7.68 22.38,9.1 22.38,11.41 19.68,11.41 19.58,11.31
VM on Top Layer: 51.28,22.8 51.28,18.37 51.21,18.3 43.3,18.3 43.3,15.7 40.35,15.7 39.65,15 39.65,13.73 37.75,13.73 37.75,16.02 39.51,17.78 39.51,19.81 42.5,22.8
VM on Top Layer: 13.13,30.11 13.13,24.64 14.89,22.87 18.48,22.87 18.48,18.08 18.44,18.05 8.28,18.05 8.28,30.11
VM on Bottom Layer: 8.37,22.87 8.37,-0.11 51.41,-0.11 51.41,23.03 47.02,23.03 47.02,2.55 13.36,2.55 13.36,22.87

Small or netless copper shapes (teardrops, artwork), in the pictures only: 121 on Top Layer, 14 on Bottom Layer, 2 on Inner1

## Text on the board
Top Layer: 2024/12/23 | Origin / 20th | 华东理工大学
Top Solder Mask Layer: 2024/12/23 | Origin / 20th | 华东理工大学
Top Silkscreen Layer: EN | ON | 过流 | 故障 | 电源 | 使能
